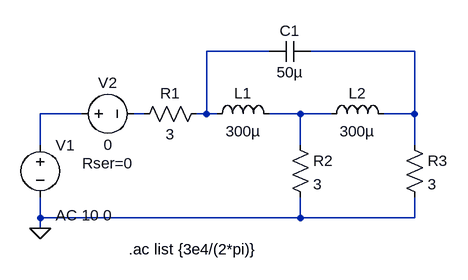
[diagram p0: schematic Problem_6.asc]
Problem_6.asc, the LTspice schematic file:
Version 4.1
SHEET 1 880 680
WIRE 288 -16 192 -16
WIRE 512 -16 352 -16
WIRE 0 80 -64 80
WIRE 96 80 80 80
WIRE 192 80 192 -16
WIRE 192 80 176 80
WIRE 208 80 192 80
WIRE 336 80 288 80
WIRE 384 80 336 80
WIRE 512 80 512 -16
WIRE 512 80 464 80
WIRE -64 128 -64 80
WIRE 336 128 336 80
WIRE 512 128 512 80
WIRE -64 240 -64 208
WIRE 336 240 336 208
WIRE 336 240 -64 240
WIRE 512 240 512 208
WIRE 512 240 336 240
WIRE -64 256 -64 240
FLAG -64 256 0
SYMBOL voltage -64 112 R0
WINDOW 123 24 124 Left 2
WINDOW 39 0 0 Left 0
SYMATTR Value2 AC 10 0
SYMATTR InstName V1
SYMATTR Value ""
SYMBOL res 192 64 R90
WINDOW 0 0 56 VBottom 2
WINDOW 3 32 56 VTop 2
SYMATTR InstName R1
SYMATTR Value 3
SYMBOL res 320 112 R0
SYMATTR InstName R2
SYMATTR Value 3
SYMBOL res 496 112 R0
SYMATTR InstName R3
SYMATTR Value 3
SYMBOL ind 192 96 R270
WINDOW 0 32 56 VTop 2
WINDOW 3 5 56 VBottom 2
SYMATTR InstName L1
SYMATTR Value 300µ
SYMATTR SpiceLine Rser=0
SYMBOL ind 368 96 R270
WINDOW 0 32 56 VTop 2
WINDOW 3 5 56 VBottom 2
SYMATTR InstName L2
SYMATTR Value 300µ
SYMATTR SpiceLine Rser=0
SYMBOL cap 288 0 R270
WINDOW 0 32 32 VTop 2
WINDOW 3 0 32 VBottom 2
SYMATTR InstName C1
SYMATTR Value 50µ
SYMBOL voltage -16 80 R270
WINDOW 0 32 56 VTop 2
WINDOW 3 -32 56 VBottom 2
WINDOW 123 0 0 Left 0
WINDOW 39 -60 56 VBottom 2
SYMATTR InstName V2
SYMATTR Value 0
SYMATTR SpiceLine Rser=0
TEXT 72 288 Left 2 !.ac list {3e4/(2*pi)}

The netlist it stands for:
* Problem_6.asc
V1 N003 0 AC 10 0
R1 N001 N004 3
R2 N005 0 3
R3 N002 0 3
L1 N001 N005 300µ Rser=0
L2 N005 N002 300µ Rser=0
C1 N001 N002 50µ
V2 N003 N004 0 Rser=0
.ac list {3e4/(2*pi)}
.backanno
.end